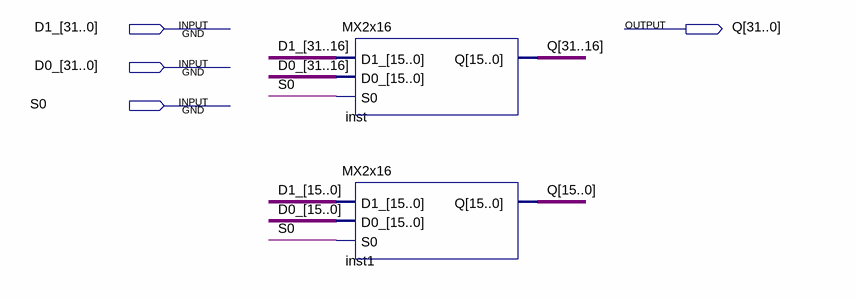
[diagram p0: schematic sheet]
// Quartus schematic MX2x32.bdf as structural Verilog: 2 symbols, 4 pins
module MX2x32 (
  input  [31:0] D1_,
  input  [31:0] D0_,
  input  S0,
  output [31:0] Q
);

  MX2x16 inst (.D1_(D1_[31:16]), .D0_(D0_[31:16]), .S0(S0), .Q(Q[31:16]));
  MX2x16 inst1 (.D1_(D1_[15:0]), .D0_(D0_[15:0]), .S0(S0), .Q(Q[15:0]));
endmodule
